# Altium schematic sheet ESP32.SchDoc
size B
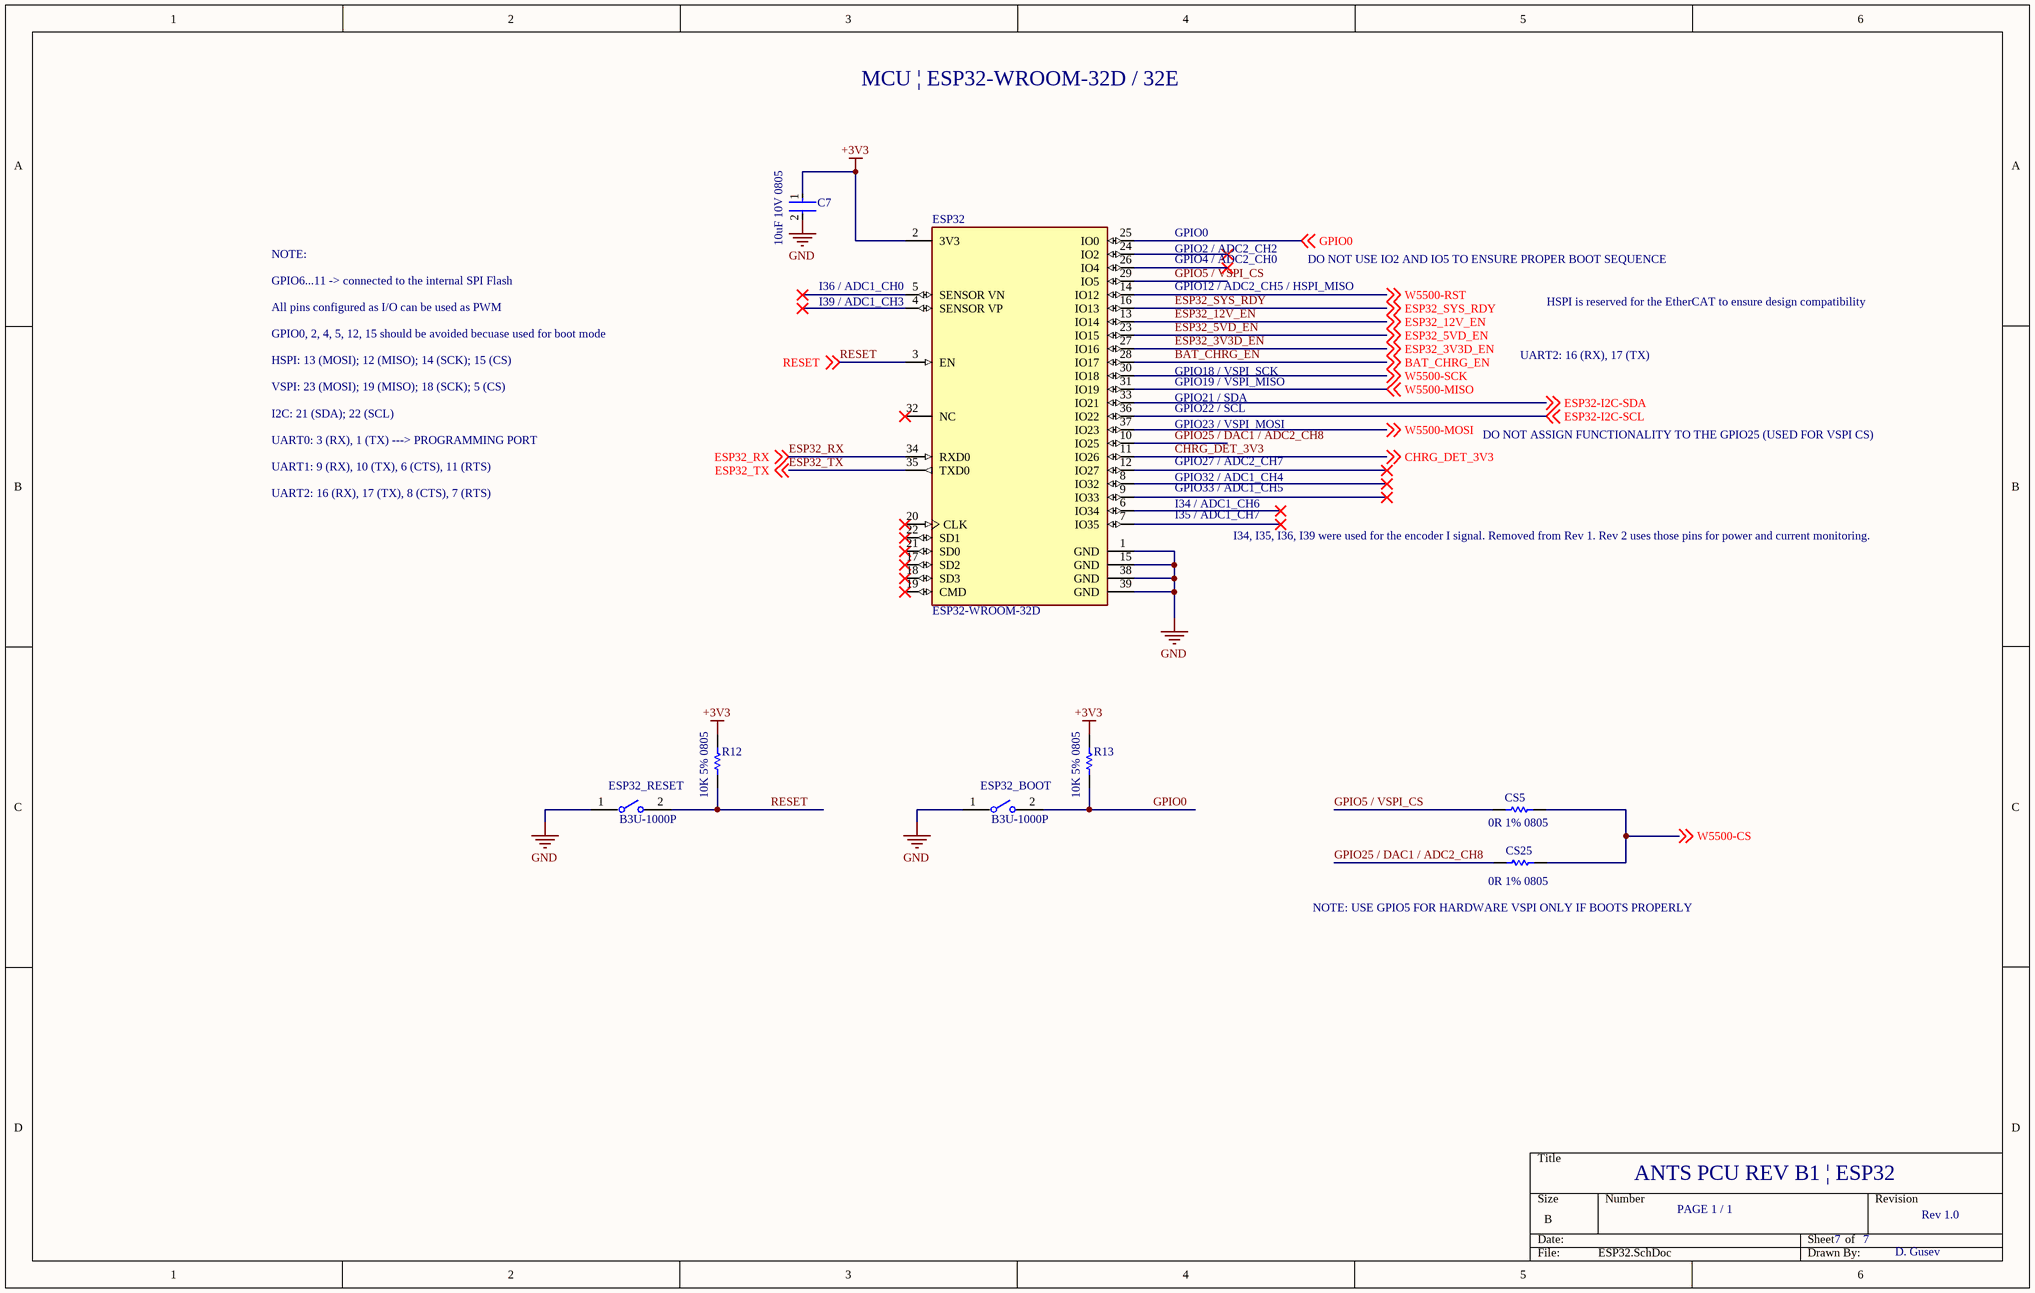
[diagram p0: ESP32.SchDoc]

## Parts
C7  10uF 10V 0805  [FP-C0805C-DG-MFG]
CS5  0R 1% 0805  [RESC2013X60X35LL10T20]
CS25  0R 1% 0805  [RESC2013X60X35LL10T20]
ESP32  ESP32-WROOM-32D  [FP-ESP32-WROOM-32D-MFG]
ESP32_BOOT  B3U-1000P  [FP-B3U-1000P-MFG]
ESP32_RESET  B3U-1000P  [FP-B3U-1000P-MFG]
R12  10K 5% 0805  [RESC2013X60X40ML20T25]
R13  10K 5% 0805  [RESC2013X60X40ML20T25]

## Nets
+3V3: C7.1 ESP32.2(3V3) R12.2 R13.2
GND: C7.2 ESP32.1(GND) ESP32.15(GND) ESP32.38(GND) ESP32.39(GND) ESP32_BOOT.1 ESP32_RESET.1
BAT_CHRG_EN: ESP32.28(IO17) ; off-sheet BAT_CHRG_EN
CHRG_DET_3V3: ESP32.11(IO26) ; off-sheet CHRG_DET_3V3
ESP32-I2C-SCL: ESP32.36(IO22) ; off-sheet ESP32-I2C-SCL
ESP32-I2C-SDA: ESP32.33(IO21) ; off-sheet ESP32-I2C-SDA
ESP32_3V3D_EN: ESP32.27(IO16) ; off-sheet ESP32_3V3D_EN
ESP32_5VD_EN: ESP32.23(IO15) ; off-sheet ESP32_5VD_EN
ESP32_12V_EN: ESP32.13(IO14) ; off-sheet ESP32_12V_EN
ESP32_RX: ESP32.34(RXD0) ; off-sheet ESP32_RX
ESP32_SYS_RDY: ESP32.16(IO13) ; off-sheet ESP32_SYS_RDY
ESP32_TX: ESP32.35(TXD0) ; off-sheet ESP32_TX
GPIO0: ESP32.25(IO0) ESP32_BOOT.2 R13.1 ; off-sheet GPIO0
GPIO5 / VSPI_CS: CS5.1 ESP32.29(IO5)
GPIO25 / DAC1 / ADC2_CH8: CS25.1 ESP32.10(IO25)
RESET: ESP32.3(EN) ESP32_RESET.2 R12.1 ; off-sheet RESET
W5500-CS: CS5.2 CS25.2 ; off-sheet W5500-CS
W5500-MISO: ESP32.31(IO19) ; off-sheet W5500-MISO
W5500-MOSI: ESP32.37(IO23) ; off-sheet W5500-MOSI
W5500-RST: ESP32.14(IO12) ; off-sheet W5500-RST
W5500-SCK: ESP32.30(IO18) ; off-sheet W5500-SCK

Not connected (* = marked no-connect by the designer): ESP32 4(SENSOR_VP)* 5(SENSOR_VN)* 6(IO34)* 7(IO35)* 8(IO32)* 9(IO33)* 12(IO27)* 17(SD2)* 18(SD3)* 19(CMD)* 20(CLK)* 21(SD0)* 22(SD1)* 24(IO2)* 26(IO4)* 32(NC)*

## Notes on the sheet
- MCU | ESP32-WROOM-32D / 32E
- GPIO0
- NOTE:
- GPIO6...11 -> connected to the internal SPI Flash
- (near ESP32) I36 / ADC1_CH0
- GPIO2 / ADC2_CH2
- GPIO4 / ADC2_CH0
- GPIO12 / ADC2_CH5 / HSPI_MISO
- DO NOT USE IO2 AND IO5 TO ENSURE PROPER BOOT SEQUENCE
- All pins configured as I/O can be used as PWM
- GPIO0, 2, 4, 5, 12, 15 should be avoided becuase used for boot mode
- HSPI: 13 (MOSI); 12 (MISO); 14 (SCK); 15 (CS)
- (near ESP32) I39 / ADC1_CH3
- UART2: 16 (RX), 17 (TX)
- HSPI is reserved for the EtherCAT to ensure design compatibility
- VSPI: 23 (MOSI); 19 (MISO); 18 (SCK); 5 (CS)
- I2C: 21 (SDA); 22 (SCL)
- GPIO18 / VSPI_SCK
- GPIO19 / VSPI_MISO
- GPIO21 / SDA
- GPIO22 / SCL
- GPIO23 / VSPI_MOSI
- DO NOT ASSIGN FUNCTIONALITY TO THE GPIO25 (USED FOR VSPI CS)
- UART0: 3 (RX), 1 (TX) ---> PROGRAMMING PORT
- UART1: 9 (RX), 10 (TX), 6 (CTS), 11 (RTS)
- UART2: 16 (RX), 17 (TX), 8 (CTS), 7 (RTS)
- GPIO27 / ADC2_CH7
- GPIO32 / ADC1_CH4
- GPIO33 / ADC1_CH5
- I34 / ADC1_CH6
- I35 / ADC1_CH7
- I34, I35, I36, I39 were used for the encoder I signal. Removed from Rev 1. Rev 2 uses those pins for power and current monitoring.
- (near CS25) NOTE: USE GPIO5 FOR HARDWARE VSPI ONLY IF BOOTS PROPERLY
- ANTS PCU REV B1 | ESP32
- PAGE 1 / 1
- 7
- Rev 1.0
- D. Gusev

## Library data of the parts
C7 = CMP-2007-03243-2: CAP CER 10UF 10V X5R 0805; Manufacturer Part Number: C0805C106K8PACTU; Manufacturer: Kemet; 3DS Part Number: 220-00001; Tolerance: 10%; Temperature Coefficient: 15%; Material: Ceramic; Device Class L2: Capacitors; Device Class L1: Passive Components; ComponentLink2URL: https://content.kemet.com/datasheets/KEM_C1006_X5R_SMD.pdf; Height: 1.4mm; Lead Free: Yes; Digikey Description: CAP CER 10UF 10V X5R 0805; Octopart: https://octopart.com/c0805c106k8pactu-kemet-98697; Capacitance: 10uF; Value: 10uF; Temperature Range Low: -55°C; Temperature: -55°C to +85°C; Automotive: No; Mouser Description: CAP CER 10UF 10V X5R 0805; Ipc Land Pattern Name: CAPC200125X125; Temperature Range High: +85°C; Voltage: 10V; RoHS: TRUE; Device Class L3: Ceramic Capacitors; ComponentLink2Description: Datasheet; Voltage Rating: 10V; Package: C0805C-DG; Temperature Characteristic: X5R; Category: Cap
CS5 CS25 = CMP-1659-00014-4: Chip Resistor, 1 Ohm, +/- 1%, 125 mW, -55 to 155 degC, 0805 (2012 Metric), RoHS, Tape and Reel; Manufacturer: Yageo; Voltage Rating: 150 V; REACH SVHC: No SVHC; Mounting Technology: Surface Mount; RoHSCompliant: true; Packaging: Tape and Reel; ComponentLink2URL: http://www.yageo.com/documents/recent/PYu-RC_Group_51_RoHS_L_04.pdf; Pins: 2; Package Quantity: 5000; DatasheetVersion: Rev. 4, 02/2016; Mount: Surface Mount; Max Operating Temperature: 155 degC; PackageDescription: 2-Pin Surface Mounted Device, Body 2 x 1.25 mm; PackageReference: 0805; Length: 2 mm; Min Operating Temperature: -55 degC; ComponentLink1URL: http://www.yageo.com/; Height: 0.5 mm; ComponentLink1Description: Manufacturer URL; ComponentLink2Description: Datasheet
ESP32 = CMP-194065-000003-1: WIFI MODULE 32MBITS SPI FLASH; Manufacturer: Espressif Systems; Max Supply Voltage: 3.6V; Nominal Supply Current: 500mA; Max Frequency: 2484MHz; Number Of Adc Channels: 16; Number Of Gpio: 32; Interface: I2C,SPI,UART,Ethernet,I2S,Other; Data Rate: 150Mbits/s; Min Supply Voltage: 3V; Bandwidth: 72MHz; Sensitivity: -98dBm; Octopart: https://octopart.com/esp32-wroom-32d-espressif+systems-91040050; Package: ESP32-WROOM-32D; ComponentLink2URL: https://www.espressif.com/sites/default/files/documentation/esp32-wroom-32d_esp32-wroom-32u_datasheet_en.pdf; Lead Free: Yes; Category: UNK; Mouser Description: Wi-Fi/BT BLE Module ESP32-D0WD, SPI Flash, UART, P; Device Class L1: Integrated Circuits (ICs); RoHS: TRUE; Temperature Range Low: -40°C; ComponentLink2Description: Datasheet; Digikey Description: WIFI MODULE 32MBITS SPI FLASH; Height: 3.2mm; Temperature: -40°C to +85°C; Manufacturer Part Number: ESP32-WROOM-32D; Device Class L3: Transceivers; Device Class L2: RF Semiconductors and Devices; Temperature Range High: +85°C; Automotive: No
ESP32_BOOT ESP32_RESET = CMP-2100-03586-2: SWITCH TACTILE SPST-NO 0.05A 12V; Contact Resistance: 100mR; Operating Force: 1.5N; Max Current Rating: 50mA; Switch Travel: 0.15mm; Actuator Type: Standard; Mechanical Life: 200000Cycles; Ratings: Dust Proof; Illumination Type: Non-Illuminated; Throw Configuration: SPST; Actuator Length: 0.4mm; Switch Function: Off-Mom; Height: 1.2mm; Width: 3mm; Weight: 0.000776oz; Contact Material: Silver; Max Voltage Rating (DC): 12V; Insulation Resistance: 100MR; Lead Free: Lead Free; Current Rating: 50mA; Termination: SMD/SMT; Length: 4mm; Voltage Rating (DC): 12V; Contact Current Rating: 50mA; Orientation: Straight; Depth: 2.5mm; Max Operating Temperature: 70°C; Packaging: Tape and Reel; Min Operating Temperature: -25°C; Package Quantity: 1; Mount: Surface Mount; Electrical Life: 200000Cycles
R12 R13 = CMP-2001-00590-1: Part Number: ERA6AEB123V; Manufacturer: Panasonic